# EAGLE design SFD_N (EAGLE 9.5.2)
Universal-Dekoder für Selectrix
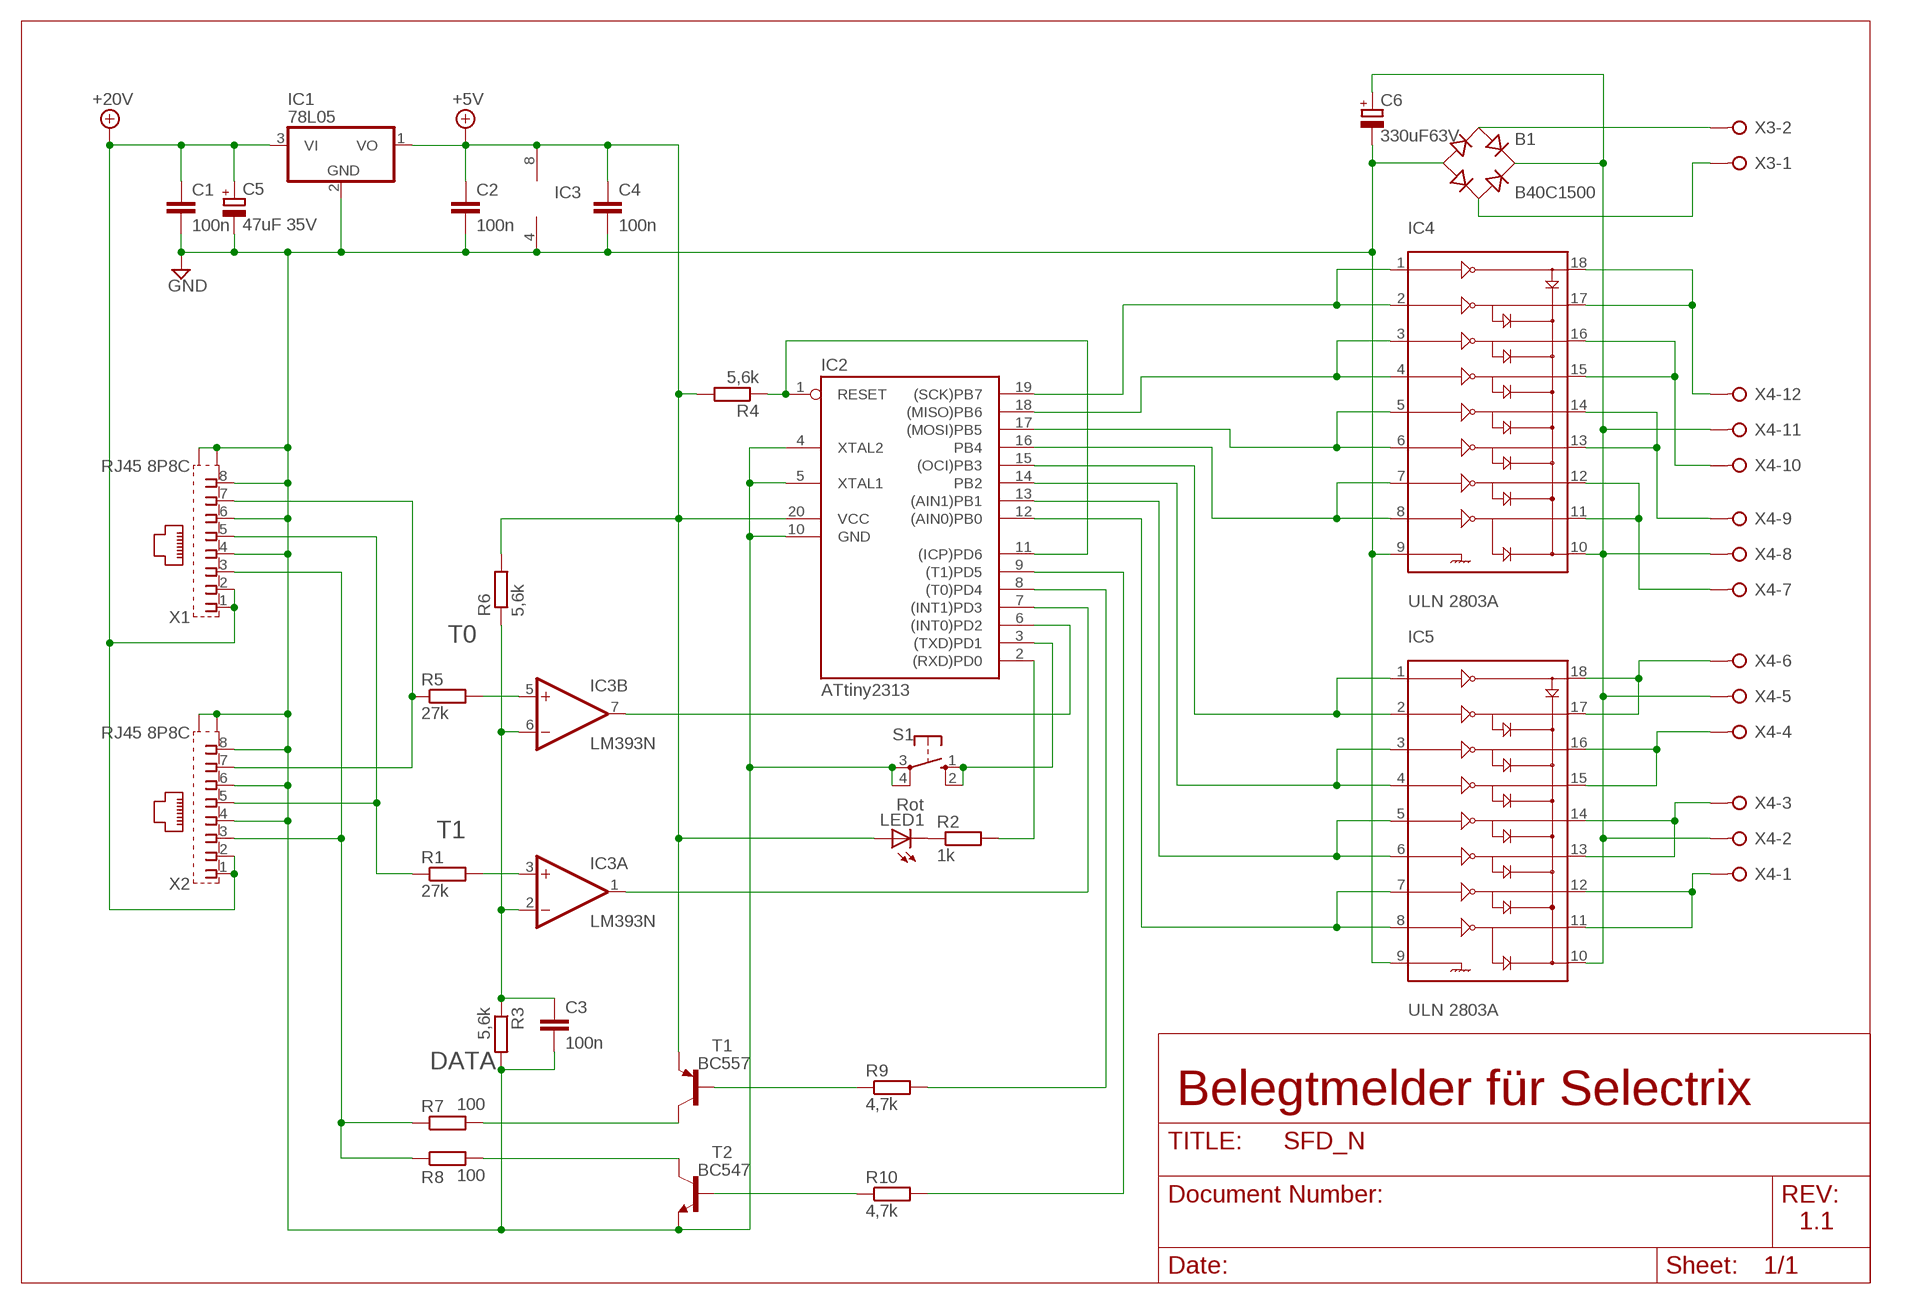
[diagram p0: schematic, sheet 1]

## Parts
B1  B40C1500  RECTIFIER-RB1A  [RB1A]
C1  100n  C-EU025-025X050  [C025-025X050]
C2  100n  C-EU025-025X050  [C025-025X050]
C3  100n  C-EU025-025X050  [C025-025X050]
C4  100n  C-EU025-025X050  [C025-025X050]
C5  47uF 35V  CPOL-EUE2,5-6E  [E2,5-6E]
C6  330uF63V  CPOL-EUE5-13  [E5-13]
IC1  78L05  78L05Z  [TO92]
IC2  ATtiny2313  AT90S2313P  [DIL20]
IC3  LM393N  [DIL08]
IC4  ULN 2803A  ULN2803  [DIL18]
IC5  ULN 2803A  ULN2803  [DIL18]
LED1  Rot  LED3MM  [LED3MM]
R1  27k  R-EU_0207/10  [0207/10]
R2  1k  R-EU_0207/10  [0207/10]
R3  5,6k  R-EU_0207/10  [0207/10]
R4  5,6k  R-EU_0207/10  [0207/10]
R5  27k  R-EU_0207/10  [0207/10]
R6  5,6k  R-EU_0207/10  [0207/10]
R7  100  R-EU_0207/10  [0207/10]
R8  100  R-EU_0207/10  [0207/10]
R9  4,7k  R-EU_0207/10  [0207/10]
R10  4,7k  R-EU_0207/10  [0207/10]
S1  10-XX  [B3F-10XX]
T1  BC557  [TO92]
T2  BC547  [TO92]
X1  RJ45 8P8C  0446200002  [0446200002]
X2  RJ45 8P8C  0446200002  [0446200002]
X3  W237-02P  [W237-132]
X4  W237-12P  [W237-12P]

## Nets
2-INT0: IC2.6((INT0)PD2) IC3.7(B:OUT)
4: IC2.7((INT1)PD3) IC3.1(A:OUT)
+10V: C1.1 C5.+ IC1.3(VI) X1.1 X1.2 X2.1 X2.2 ; supply symbol labelled +20V
+20V: C2.1 C4.1 IC1.1(VO) IC2.20(VCC) IC3.8(P:V+) LED1.A R4.2 R6.2 T1.1(E) ; supply symbol labelled +5V
DATA: R7.1 R8.1 X1.3 X2.3
GND: B1.- C1.2 C2.2 C3.2 C4.2 C5.- C6.- IC1.2(GND) IC2.4(XTAL2) IC2.5(XTAL1) IC2.10(GND) IC3.4(P:V-) IC4.9 IC5.9 R3.2 S1.3(P) S1.4(P1) T2.1(E) X1.4 X1.6 X1.8 X1.S@1(S1) X1.S@2(S2) X2.4 X2.6 X2.8 X2.S@1(S1) X2.S@2(S2)
N$1: IC2.3((TXD)PD1) S1.1(S) S1.2(S1)
N$2: IC2.8((T0)PD4) R9.2
N$3: R7.2 T1.3(C)
N$4: IC3.5(B:+IN) R5.2
N$5: IC3.3(A:+IN) R1.2
N$6: LED1.K(C) R2.1
N$7: C3.1 IC3.2(A:-IN) IC3.6(B:-IN) R3.1 R6.1
N$8: IC2.2((RXD)PD0) R2.2
N$9: R8.2 T2.3(C)
N$12: IC2.1(RESET) IC2.11((ICP)PD6) R4.1
N$13: IC2.12((AIN0)PB0) IC5.7 IC5.8
N$14: IC2.13((AIN1)PB1) IC5.5 IC5.6
N$15: IC2.14(PB2) IC5.3 IC5.4
N$17: IC2.15((OCI)PB3) IC5.1 IC5.2
N$18: IC2.16(PB4) IC4.7 IC4.8
N$19: IC2.17((MOSI)PB5) IC4.5 IC4.6
N$20: IC2.19((SCK)PB7) IC4.1 IC4.2
N$21: IC2.18((MISO)PB6) IC4.3 IC4.4
N$22: B1.AC2 X3.1
N$23: IC2.9((T1)PD5) R10.2
N$24: B1.+ C6.+ IC4.10 IC5.10 X4.2 X4.5 X4.8 X4.11
N$25: R9.1 T1.2(B)
N$26: IC4.17 IC4.18 X4.12
N$27: R10.1 T2.2(B)
N$28: IC4.15 IC4.16 X4.10
N$29: IC4.13 IC4.14 X4.9
N$30: IC4.11 IC4.12 X4.7
N$31: IC5.17 IC5.18 X4.6
N$32: IC5.15 IC5.16 X4.4
N$34: IC5.13 IC5.14 X4.3
N$35: B1.AC1 X3.2
N$36: IC5.11 IC5.12 X4.1
T0: R5.1 X1.7 X2.7
T1: R1.1 X1.5 X2.5

## Notes on the sheet
- IC3
- Belegtmelder für Selectrix
- 1.1

## Library data of the parts
B1 = rectifier:RECTIFIER-: Rectifier
C1-C4 = rcl:C-EU: CAPACITOR, European symbol
C5 = rcl:CPOL-EU: POLARIZED CAPACITOR, European symbol
C6 = rcl:CPOL-EU: POLARIZED CAPACITOR, European symbol; SPICEPREFIX: C
IC1 = linear3:78*: Positive VOLTAGE REGULATOR Source: http://cache.national.com/ds/LM/LM78L05.pdf http://www.fairchildsemi.com/ds/LM/LM7805.pdf
IC2 = atmel:AT90S2313: MICROCONTROLLER 2 Kbytes FLASH 128 bytes SRAM 128 bytes EEPROM UART; OC_FARNELL: unknown; OC_NEWARK: unknown
IC3 = linear3:LM393: COMPARATOR
IC4 IC5 = transistor-arrays-1:ULN2803: ULN2803- Darlington Array Featuring continious load ratings to 500mA for each of the drivers.
LED1 = led:LED: LED OSRAM: - CHIPLED LG R971, LG N971, LY N971, LG Q971, LY Q971, LO R971, LY R971 LH N974, LH R974 LS Q976, LO Q976, LY Q976 LO Q996 - Hyper CHIPLED LW Q18S LB Q993, LB Q99A, LB R99A - SideLED LS A670, LO A670, LY A670, LG A670, LP A670 LB A673, LV A673, LT A673, LW A673 LH A674 LY A675 LS A676, LA A676, LO A676, LY A676, LW A676 LS A679, LY A679, LG A679 - Hyper Micro SIDELED® LS Y876, LA Y876, LO Y876, LY Y876 LT Y87S - SmartLED LW L88C, LW L88S LB L89C, LB L89S, LG L890 LS L89K, LO L89K, LY L89K LS L896, LA L896, LO L896, LY L896 - TOPLED LS T670, LO T670, LY T670, LG T670, LP T670 LSG T670, LSP T670, LSY T670, LOP T670, LYG T670 LG T671, LOG T671, LSG T671 LB T673, LV T673, LT T673, LW T673 LH T674 LS T676, LA T676, LO T676, LY T676, LB T676, LH T676, LSB T676, LW T676 LB T67C, LV T67C, LT T67C, LS T67K, LO T67K, LY T67K, LW E67C LS E67B, LA E67B, LO E67B, LY E67B, LB E67C, LV E67C, LT E67C LW T67C LS T679, LY T679, LG T679 LS T770, LO T770, LY T770, LG T770, LP T770 LB T773, LV T773, LT T773, LW T773 LH T774 LS E675, LA E675, LY E675, LS T675 LS T776, LA T776, LO T776, LY T776, LB T776 LHGB T686 LT T68C, LB T68C - Hyper Mini TOPLED® LB M676 - Mini TOPLED Santana® LG M470 LS M47K, LO M47K, LY M47K Source: http://www.osram.convergy.de LUXEON: - LUMILED® LXK2-PW12-R00, LXK2-PW12-S00, LXK2-PW14-U00, LXK2-PW14-V00 LXK2-PM12-R00, LXK2-PM12-S00, LXK2-PM14-U00 LXK2-PE12-Q00, LXK2-PE12-R00, LXK2-PE12-S00, LXK2-PE14-T00, LXK2-PE14-U00 LXK2-PB12-K00, LXK2-PB12-L00, LXK2-PB12-M00, LXK2-PB14-N00, LXK2-PB14-P00, LXK2-PB14-Q00 LXK2-PR12-L00, LXK2-PR12-M00, LXK2-PR14-Q00, LXK2-PR14-R00 LXK2-PD12-Q00, LXK2-PD12-R00, LXK2-PD12-S00 LXK2-PH12-R00, LXK2-PH12-S00 LXK2-PL12-P00, LXK2-PL12-Q00, LXK2-PL12-R00 Source: www.luxeon.com KINGBRIGHT: KA-3528ASYC Source: www.kingbright.com
R1-R10 = rcl:R-EU_: RESISTOR, European symbol
S1 = switch-omron:10-XX: OMRON SWITCH; MPN: B3F-1000; OC_FARNELL: 176432; OC_NEWARK: 36M3542
T1 = transistor-pnp:BC557: PNP Transistor
T2 = transistor:BC547: NPN TRANSISTOR
X1 X2 = con-molex:0446200002: RJ-45 INVERTED MODULAR JACK ASSEMBLY WITH RJ-11 KEEPOUT FEATURE Source: Data sheet <http://www.farnell.com/datasheets/73207.pdf> MOLEX 0446200002 BUCHSE, RJ45, GESCHIRMT Source: Farnell <http://de.farnell.com/molex/0446200002/buchse-rj45-geschirmt/dp/9251910?ost=9251910>; MF: MOLEX; MPN: 0446200002; OC_FARNELL: 9251910
X3 = con-wago-508:W237-02P: WAGO SREW CLAMP; OC_FARNELL: unknown; OC_NEWARK: unknown
X4 = con-wago-508:W237-12P: WAGO SREW CLAMP; OC_FARNELL: unknown; OC_NEWARK: unknown

## Board
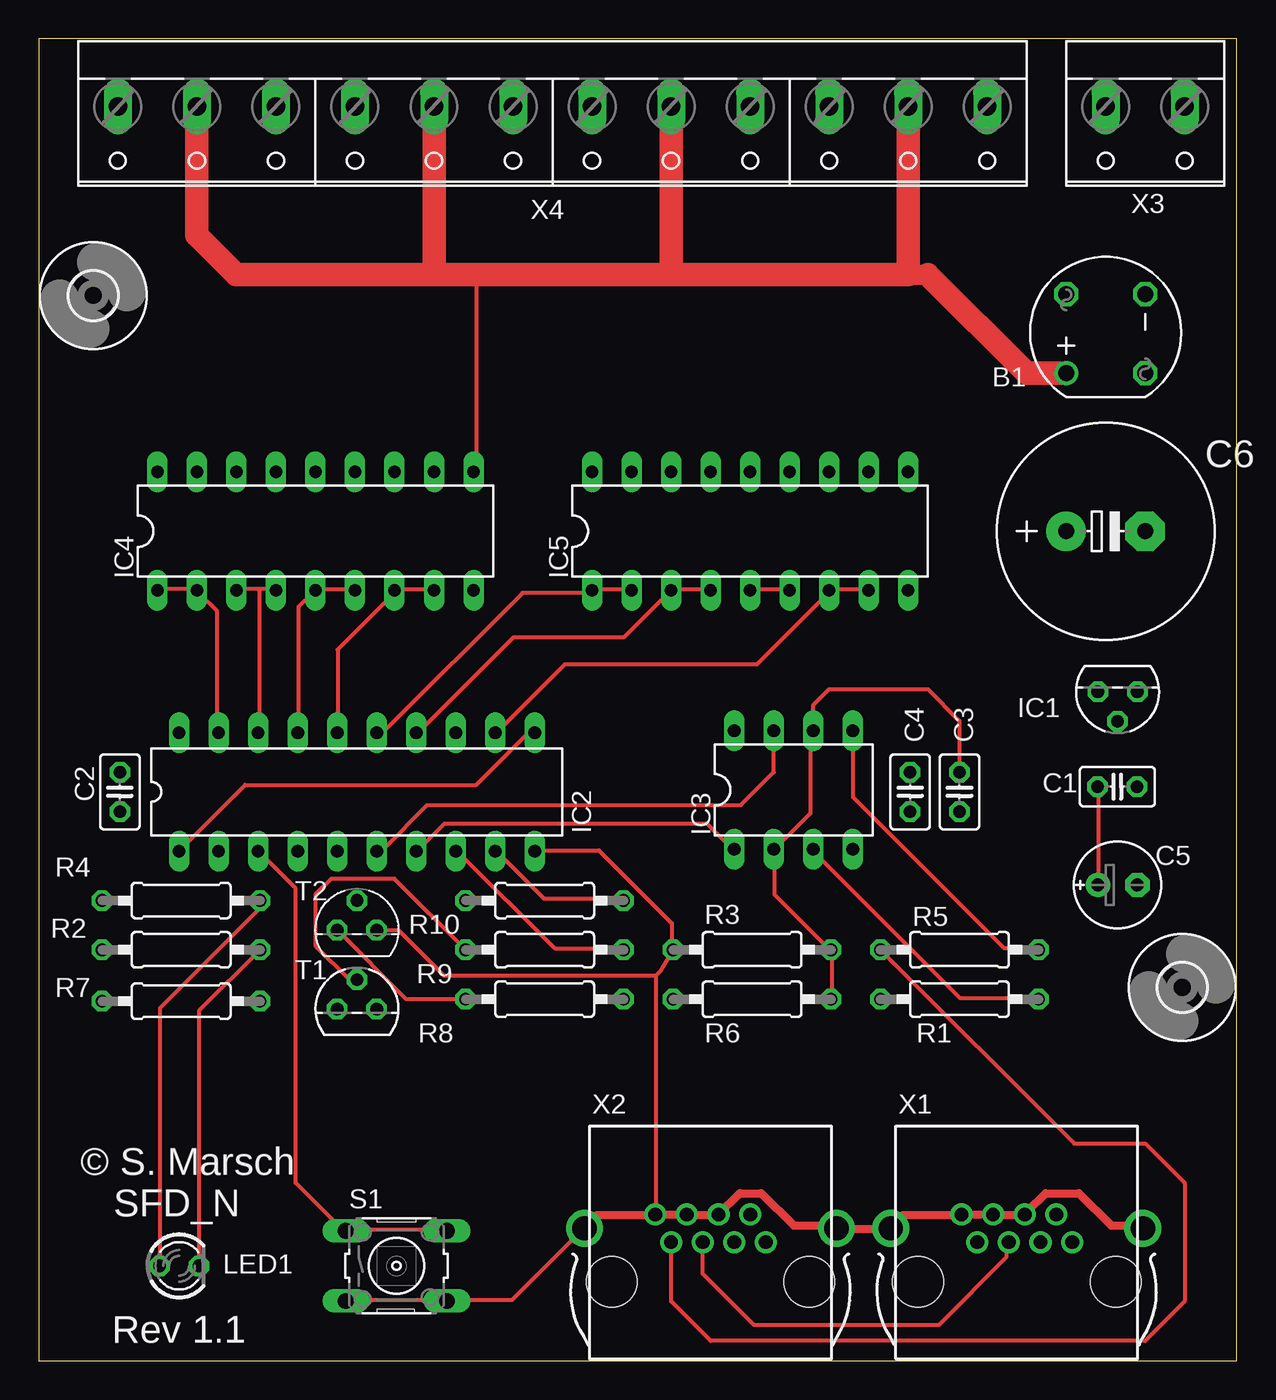
[diagram p1: board, top side]
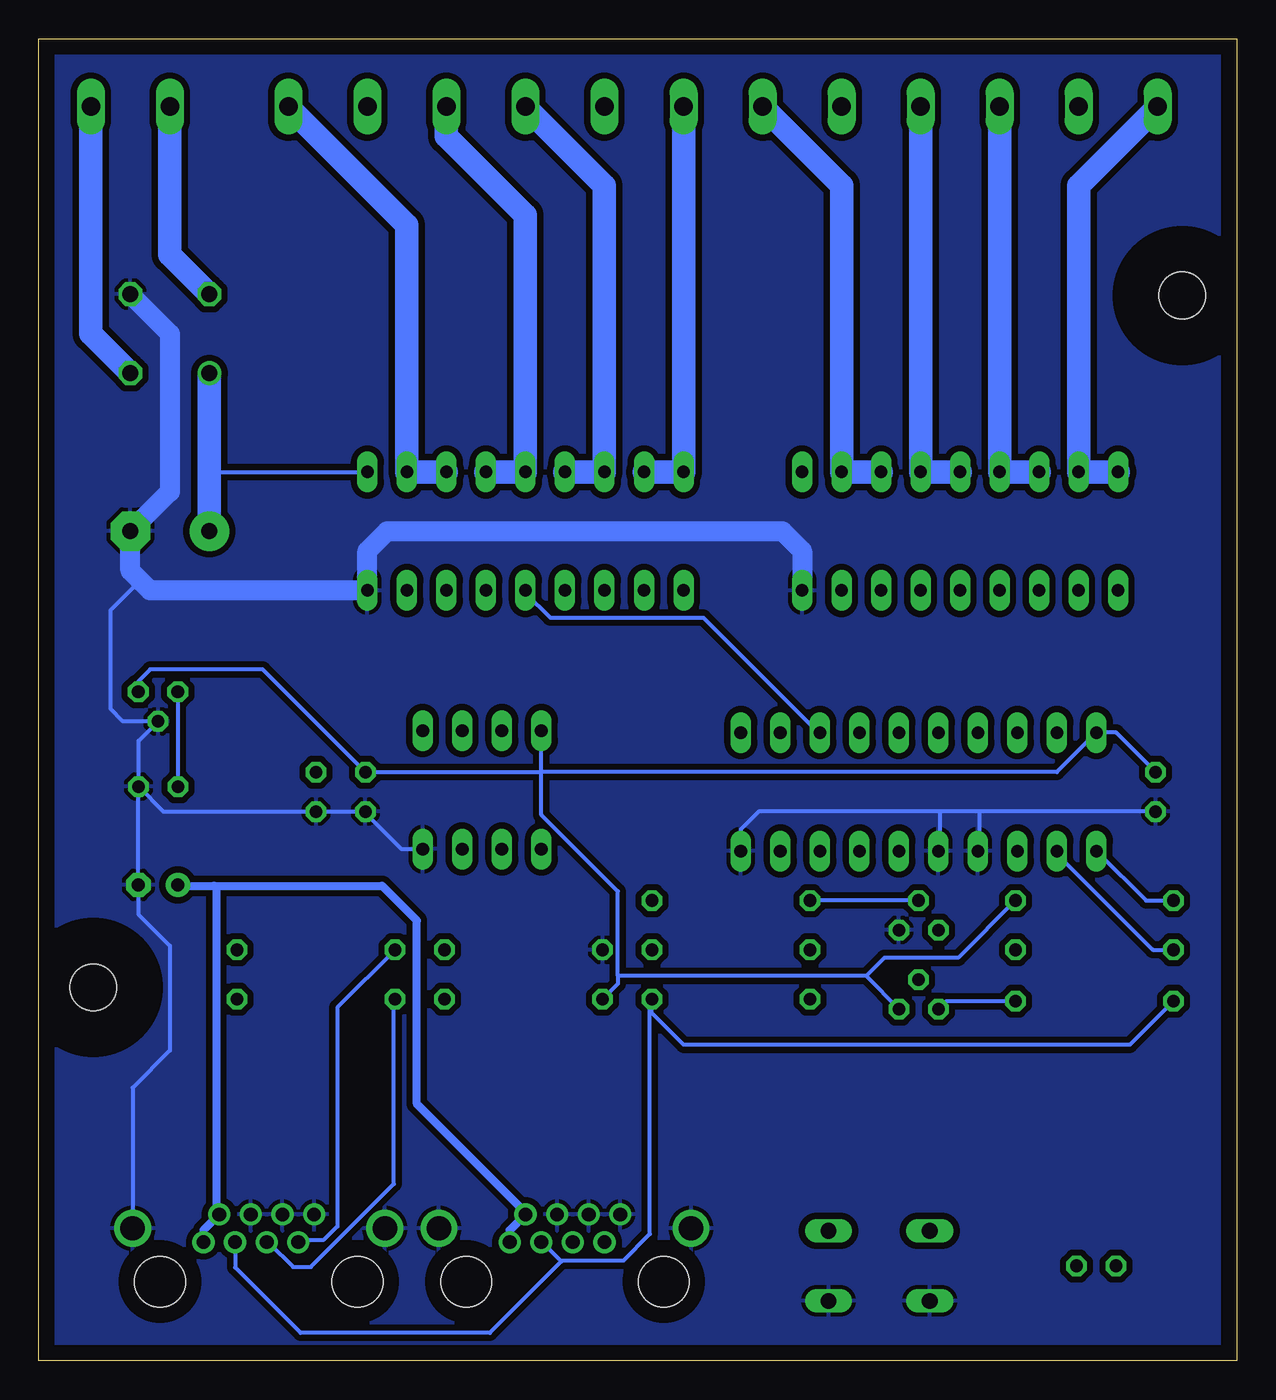
[diagram p2: board, bottom side, seen from below]

Size 77 x 85 mm. Coordinates in mm from the lower left corner, seen from the top.
Outline: 0,0 77,0 77,85 0,85 0,0
Copper layers (1*16): Top 0.035mm / dielectric 1.5mm / Bottom 0.035mm
Design rules "default *": minimum track width 10mil, minimum drill 24mil, track to track 8mil, track to pad 8mil, pad to pad 8mil, via to via 8mil, smd to smd 8mil, copper to edge 40mil, drill to drill 8mil, minimum pad ring 10mil, minimum via ring 8mil, stop-mask expansion 4mil, vias tented up to drill 0mil, thermal gap 10mil

### Footprints (pad centres in the part's own frame; a part is rotated, then mirrored left to right if it is on the bottom)
RB1A = drill 1.016: + -2.54,2.54 | drill 1.016 octagon: - 2.54,-2.54; AC1 2.54,2.54; AC2 -2.54,-2.54
C025-025X050 = drill 0.813 octagon: 1 -1.27,0; 2 1.27,0
E2,5-6E = drill 0.813 pad 1.575: + -1.27,0 | drill 0.813 pad 1.575 octagon: - 1.27,0
E5-13 = drill 1.016 pad 2.54: + -2.54,0 | drill 1.016 pad 2.54 octagon: - 2.54,0
TO92 = drill 0.813 octagon: 1 -1.27,0; 2 0,1.905; 3 1.27,0
DIL20 = drill 0.813 long: 1 -11.43,-3.81; 2 -8.89,-3.81; 3 -6.35,-3.81; 4 -3.81,-3.81; 5 -1.27,-3.81; 6 1.27,-3.81; 7 3.81,-3.81; 8 6.35,-3.81; 9 8.89,-3.81; 10 11.43,-3.81; 11 11.43,3.81; 12 8.89,3.81; 13 6.35,3.81; 14 3.81,3.81; 15 1.27,3.81; 16 -1.27,3.81; 17 -3.81,3.81; 18 -6.35,3.81; 19 -8.89,3.81; 20 -11.43,3.81
DIL08 = drill 0.813 long: 1 -3.81,-3.81; 2 -1.27,-3.81; 3 1.27,-3.81; 4 3.81,-3.81; 5 3.81,3.81; 6 1.27,3.81; 7 -1.27,3.81; 8 -3.81,3.81
DIL18 = drill 0.813 long: 1 -10.16,-3.81; 2 -7.62,-3.81; 3 -5.08,-3.81; 4 -2.54,-3.81; 5 0,-3.81; 6 2.54,-3.81; 7 5.08,-3.81; 8 7.62,-3.81; 9 10.16,-3.81; 10 10.16,3.81; 11 7.62,3.81; 12 5.08,3.81; 13 2.54,3.81; 14 0,3.81; 15 -2.54,3.81; 16 -5.08,3.81; 17 -7.62,3.81; 18 -10.16,3.81
LED3MM = drill 0.813 octagon: A -1.27,0; K 1.27,0
0207/10 = drill 0.813 octagon: 1 -5.08,0; 2 5.08,0
B3F-10XX = drill 1.016 long: 1 -3.251,2.261; 2 3.251,2.261; 3 -3.251,-2.261; 4 3.251,-2.261
TO92' = drill 0.813 octagon: 1 1.27,0; 2 0,1.905; 3 -1.27,0
3,0 = hole 3: 0,0
0446200002 = drill 0.889 pad 1.422: 1 3.556,2.54; 2 2.54,4.318; 3 1.524,2.54; 4 0.508,4.318; 5 -0.508,2.54; 6 -1.524,4.318; 7 -2.54,2.54; 8 -3.556,4.318 | drill 1.575 pad 2.286: S@1 -8.103,3.429; S@2 8.103,3.429 | hole 3.251: 6.35,0; -6.35,0
W237-132 = drill 1.194 long: 1 -2.54,-0.635; 2 2.54,-0.635
W237-12P = drill 1.194 long: 1 -27.94,-0.635; 2 -22.86,-0.635; 3 -17.78,-0.635; 4 -12.7,-0.635; 5 -7.62,-0.635; 6 -2.54,-0.635; 7 2.54,-0.635; 8 7.62,-0.635; 9 12.7,-0.635; 10 17.78,-0.635; 11 22.86,-0.635; 12 27.94,-0.635

### Placement (x,y rotation side)
B1  68.58,66.04 90 top
C1  69.33,36.91 0 top
C2  5.21,36.58 270 top
C3  59.18,36.58 270 top
C4  56.01,36.58 270 top
C5  69.34,30.59 0 top
C6  68.58,53.34 0 top
IC1  69.34,43.02 180 top
IC2  20.45,36.58 0 top
IC3  48.51,36.7 0 top
IC4  17.78,53.34 0 top
IC5  45.72,53.34 0 top
LED1  9.02,6.1 0 top
R1  59.18,23.24 0 top
R2  9.14,26.42 180 top
R3  45.85,26.42 180 top
R4  9.14,29.59 0 top
R5  59.18,26.42 0 top
R6  45.85,23.24 180 top
R7  9.14,23.11 0 top
R8  32.51,23.24 180 top
R9  32.51,26.42 0 top
R10  32.51,29.59 0 top
S1  22.99,6.1 0 top
T1  BC557  [TO92']  20.45,22.61 0 top
T2  BC547  [TO92']  20.45,27.69 0 top
U$1  [3,0]  3.5,68.5 0 top
U$2  [3,0]  73.5,24 0 top
X1  62.87,5.08 0 top
X2  43.18,5.08 0 top
X3  71.12,80.01 180 top
X4  33.02,80.01 180 top

### Tracks (layer width: path | path; a pad name or v marks a point on that pad's centre or on a via)
2-INT0
  Top 0.254: IC2.6 21.72,32.92 22.17,32.92 24.98,35.73 45.12,35.73 47.24,37.85 IC3.7
4
  Top 0.254: IC2.7 24.46,32.92 26.06,34.52 42.98,34.52 44.58,32.92 IC3.1
+10V
  Top 0.254: C1.1 68.12,36.8 68.12,30.63 C5.+
  Bottom 0.254: 65.61,9.6 X1.2 | IC1.3 68.07,37.03 68.12,37.03 C1.1 | 65.73,30.53 65.61,30.4 | C5.+ 68.12,30.63 68.01,30.53
  Bottom 0.508: 65.61,30.4 65.61,9.6 | X2.1 46.74,8.38 X2.2 45.72,9.53 52.7,16.51 52.7,28.3 54.94,30.53 65.73,30.53 68.01,30.53 | X1.2 66.42,8.38 X1.1
+20V
  Top 0.254: LED1.A 7.77,6.17 7.77,22.66 14.16,29.05 14.16,29.53 R4.2
  Bottom 0.254: 23.81,24.74 39.78,24.74 | 23.81,24.74 T1.1 | 44.7,37.85 44.7,35.1 39.78,30.18 39.78,24.74 | 44.7,37.85 IC3.8 | 44.7,37.85 C4.1 62.61,44.45 69.85,44.45 70.61,43.69 IC1.1 | 44.7,37.85 11.56,37.85 IC2.20 7.75,40.39 C2.1 | 39.78,24.74 39.78,24.23 R6.2 | R4.2 17.91,25.91 22.64,25.91 23.81,24.74
DATA
  Bottom 0.254: 43.41,6.38 44.58,7.54 X2.3 | X1.3 64.39,5.99 60.17,1.78 48.01,1.78 43.41,6.38 | 43.41,6.38 43.36,6.43 39.45,6.43 37.72,8.15 37.72,23.11 R8.1 37.59,22.35 35.56,20.32 6.86,20.32 R7.1
GND
  Top 0.254: 61.27,9.37 X1.6 | 63.32,9.37 X1.4 63.55,9.6 | 59.21,9.37 X1.8 | 54.86,8.69 X1.S@1 54.63,8.46 | 70.87,8.69 X1.S@2 | S1.3 19.89,3.89 26.06,3.89 S1.4 26.29,3.89 30.4,3.89 34.98,8.46 X2.S@1 35.2,8.69 | 39.78,9.37 X2.8 39.55,9.37 | 41.6,9.37 X2.6 | 43.66,9.37 X2.4 | 51.21,8.69 X2.S@2 | 39.65,24.74 39.65,24.77 26.04,24.77 23.11,27.69 T2.1 | 39.65,24.74 39.65,9.43 | 39.65,24.74 39.93,25.02 R3.2 40.69,26.52 40.69,28.12 35.99,32.82 31.93,32.82 IC2.10
  Top 0.508: 61.27,9.37 59.44,9.37 X1.8 | 63.32,9.37 61.49,9.37 X1.6 | 59.21,9.37 55.55,9.37 54.86,8.69 | 54.63,8.46 51.44,8.46 X2.S@2 | 70.87,8.69 68.94,8.69 66.85,10.77 64.72,10.77 63.55,9.6 | 41.6,9.37 39.78,9.37 | 43.66,9.37 41.83,9.37 X2.6 | 39.55,9.37 35.89,9.37 35.2,8.69 | 51.21,8.69 48.51,8.69 46.43,10.77 45.06,10.77 X2.4 | 39.65,9.43 X2.8
  Bottom 0.254: IC3.4 52.35,32.92 53.72,32.92 56.01,35.2 C4.2 C3.2 68.99,35.31 C1.2 | C2.2 16.51,35.31 | 16.51,35.31 19.05,35.31 | 19.05,35.31 30.73,35.31 31.88,34.16 IC2.10 | C1.2 70.61,36.89 C5.- 70.61,28.7 68.58,26.67 68.58,19.94 70.97,17.55 X1.S@2 | C1.2 70.6,39.86 IC1.2 71.6,41.12 72.39,41.91 72.39,48.26 70.48,50.16 | IC2.4 16.51,32.89 16.51,35.31 | IC2.5 19.05,32.89 19.05,35.31
  Bottom 1.27: B1.- 68.58,66.04 68.58,55.88 C6.- 71.12,50.8 70.48,50.16 69.85,49.53 IC5.9 55.88,52.07 54.61,53.34 29.21,53.34 27.94,52.07 IC4.9
  pour Bottom (isolate 0.406): 0,0 77.47,0 77.47,85.09 0,85.09
N$1
  Top 0.254: S1.2 26.06,8.46 19.89,8.46 S1.1 19.58,8.36 16.51,11.43 16.51,30.35 IC2.3
N$2
  Top 0.254: R9.2 37.49,26.52 33.15,26.52 26.98,32.69 IC2.8
N$3
  Bottom 0.254: R7.2 18.67,23.11 T1.3
N$4
  Top 0.254: IC3.5 52.35,40.46 52.35,36.22 62.05,26.52 64.24,26.52 R5.2
N$5
  Top 0.254: R1.2 64.24,23.32 59.21,23.32 49.84,32.69 IC3.3
N$6
  Top 0.254: LED1.K 10.29,22.48 R2.1
N$7
  Top 0.254: R6.1 50.98,23.32 50.98,26.29 R3.1 50.75,26.52 47.32,29.95 47.32,32.69 IC3.2 47.32,32.92 49.61,35.2 49.61,40.46 IC3.6 49.78,42.16 50.8,43.18 57.15,43.18 59.18,41.15 C3.1
N$8
  Bottom 0.254: R2.2 5.38,26.42 11.66,32.69 IC2.2
N$9
  Top 0.254: R8.2 23.62,23.24 T2.3
N$12
  Top 0.254: IC2.11 31.77,40.23 31.32,40.23 28.12,37.03 13.26,37.03 9.14,32.92 IC2.1
  Bottom 0.254: R4.1 5.82,29.59 8.91,32.69 IC2.1
N$13
  Top 0.254: IC2.12 29.49,40.46 33.81,44.78 46.15,44.78 50.75,49.38 IC5.7 50.98,49.61 53.26,49.61 IC5.8
N$14
  Top 0.254: IC5.6 48.23,49.61 45.72,49.61 IC5.5
  Bottom 0.254: IC2.13 26.98,40.46 34.29,47.78 44.12,47.78 45.72,49.38 IC5.5
N$15
  Top 0.254: IC2.14 24.46,40.46 30.5,46.51 37.59,46.51 40.46,49.38 IC5.3 40.69,49.61 42.98,49.61 IC5.4
N$17
  Top 0.254: IC2.15 21.72,40.46 22.17,40.46 31.09,49.38 35.43,49.38 IC5.1 35.66,49.61 37.95,49.61 IC5.2
N$18
  Top 0.254: IC2.16 19.2,40.46 19.2,45.72 22.86,49.38 IC4.7 22.86,49.61 25.38,49.61 IC4.8
N$19
  Top 0.254: IC2.17 16.69,40.46 16.69,48.46 17.6,49.38 IC4.5 17.83,49.61 20.12,49.61 IC4.6
N$20
  Top 0.254: IC4.1 7.77,49.61 10.06,49.61 IC4.2 10.29,49.38 11.43,48.23 11.43,40.46 IC2.19
N$21
  Top 0.254: 14.17,49.61 15.09,49.61 IC4.4 | 14.17,49.61 12.8,49.61 IC4.3 | 14.17,49.61 14.17,40.46 IC2.18
N$22
  Bottom 1.524: X3.1 73.66,66.04 B1.AC2
N$23
  Top 0.254: R10.2 37.49,29.72 32.46,29.72 29.49,32.69 IC2.9
N$24
  Top 0.254: 28.12,69.85 28.12,57.15 IC4.10
  Top 1.27: 55.88,69.85 57.15,69.85
  Top 1.524: X4.11 10.16,72.39 12.7,69.85 25.4,69.85 | 25.4,69.85 28.12,69.85 40.64,69.85 | 40.64,69.85 55.88,69.85 X4.2 | 57.15,69.85 63.5,63.5 B1.+ | X4.5 40.64,69.85 | X4.8 25.4,69.85
  Bottom 0.254: 66.04,57.15 IC5.10
  Bottom 1.524: B1.+ 66.04,57.15 C6.+
N$25
  Top 0.254: R9.1 22.86,30.99 18.8,30.99 17.78,29.97 17.78,26.67 19.94,24.51 T1.2
N$26
  Bottom 1.524: X4.12 10.16,75.56 IC4.17 IC4.18
N$27
  Bottom 0.254: T2.2 R10.1
N$28
  Bottom 1.524: X4.10 IC4.15 IC4.16
N$29
  Bottom 1.524: X4.9 IC4.13 IC4.14
N$30
  Bottom 1.524: X4.7 25.4,75.56 IC4.11 IC4.12
N$31
  Bottom 1.524: X4.6 IC5.18 IC5.17
N$32
  Bottom 1.524: X4.4 40.64,75.56 IC5.16 IC5.15
N$34
  Bottom 1.524: X4.3 50.8,78.74 45.72,73.66 IC5.14 IC5.13
N$35
  Bottom 1.524: X3.2 68.58,71.12 B1.AC1
N$36
  Bottom 1.524: X4.1 53.34,73.03 IC5.11 IC5.12
T0
  Top 0.254: R5.1 66.55,13.97 71.12,13.97 73.66,11.43 73.66,3.81 71.12,1.27 43.18,1.27 40.64,3.81 X2.7
  Bottom 0.254: X1.7 60.12,7.77 58.67,7.77 57.81,8.64 57.81,22.71 R5.1
T1
  Top 0.254: X2.5 42.67,5.59 45.97,2.29 57.84,2.29 62.18,6.63 62.18,7.54 X1.5
  Bottom 0.254: R1.1 54.18,23.09 54.18,11.35 59.51,6.02 60.66,6.02 62.18,7.54 X1.5

### Text on the board
tNames: © S. Marsch / SFD_N | Rev 1.1